# EAGLE design stm32h405-braids (EAGLE 7.2.0)
Braids for Olimex STM32H103 or H405 with some tweaks

## Sheet 1 of 2
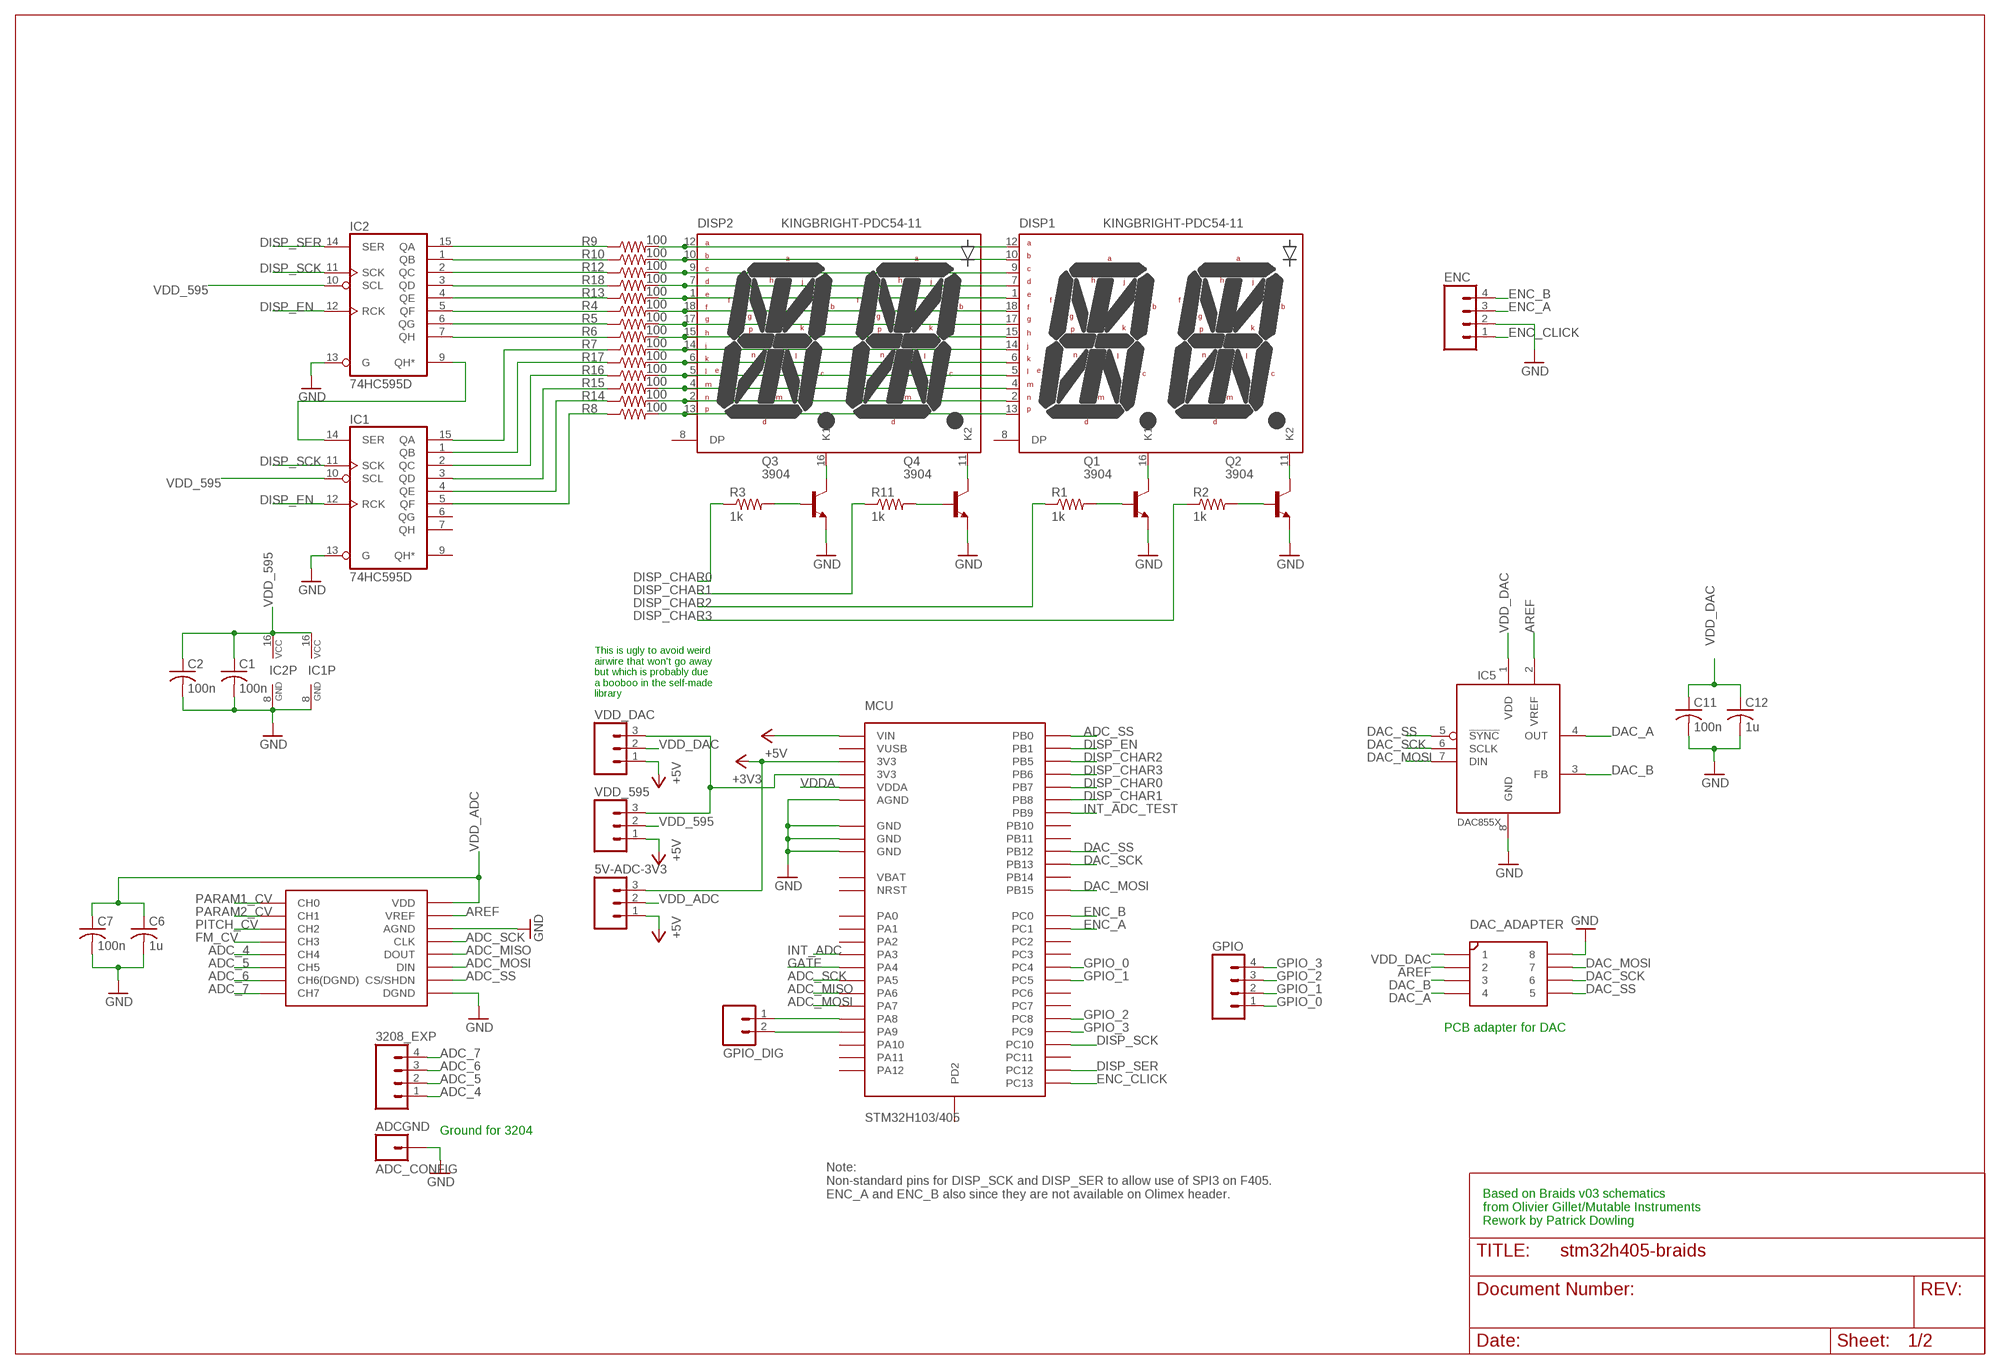
[diagram p0: schematic, sheet 1]

### Parts
5V-ADC-3V3  M031X03_NO_SILK  [1X03_NO_SILK]
3208_EXP  M041X04_NO_SILK  [1X04_NO_SILK]
ADCGND  ADC_CONFIG  M01NOSILK-KIT  [1X01NS-KIT]
C1  100n  C-USC0805  [C0805]
C2  100n  C-USC0805  [C0805]
C6  1u  C-USC0805  [C0805]
C7  100n  C-USC0805  [C0805]
C11  100n  C-USC0805  [C0805]
C12  1u  C-USC0805  [C0805]
DAC_ADAPTER  DILSOP  [DILSOP]
DISP1  KINGBRIGHT-PDC54-11  [PDC54]
DISP2  KINGBRIGHT-PDC54-11  [PDC54]
ENC  M04PTH  [1X04]
GPIO  M04NO_SILK_ALL_ROUND  [1X04_NO_SILK_ALL_ROUND]
GPIO_DIG  M02PTH  [1X02]
IC1  74HC595D  [SO16]
IC2  74HC595D  [SO16]
IC4  MCP3204/3208  MCP320X  [DIL16]
IC5  DAC855X  [MSOP-8]
MCU  STM32H103/405  STM32H103  [STM32H103]
Q1  3904  MMBT3904LT1-NPN-SOT23-BEC  [SOT23-BEC]
Q2  3904  MMBT3904LT1-NPN-SOT23-BEC  [SOT23-BEC]
Q3  3904  MMBT3904LT1-NPN-SOT23-BEC  [SOT23-BEC]
Q4  3904  MMBT3904LT1-NPN-SOT23-BEC  [SOT23-BEC]
R1  1k  R-US_R0805  [R0805]
R2  1k  R-US_R0805  [R0805]
R3  1k  R-US_R0805  [R0805]
R4  100  R-US_R0603  [R0603]
R5  100  R-US_R0603  [R0603]
R6  100  R-US_R0603  [R0603]
R7  100  R-US_R0603  [R0603]
R8  100  R-US_R0603  [R0603]
R9  100  R-US_R0603  [R0603]
R10  100  R-US_R0603  [R0603]
R11  1k  R-US_R0805  [R0805]
R12  100  R-US_R0603  [R0603]
R13  100  R-US_R0603  [R0603]
R14  100  R-US_R0603  [R0603]
R15  100  R-US_R0603  [R0603]
R16  100  R-US_R0603  [R0603]
R17  100  R-US_R0603  [R0603]
R18  100  R-US_R0603  [R0603]
VDD_595  M031X03_NO_SILK  [1X03_NO_SILK]
VDD_DAC  M031X03_NO_SILK  [1X03_NO_SILK]

### Nets
+3V3: 5V-ADC-3V3.3 MCU.EXT1-5(3V3) ; also sheet 2
+5V: 5V-ADC-3V3.1 MCU.EXT2-26(VIN) VDD_595.1 VDD_DAC.1 ; also sheet 2
ADC_4: 3208_EXP.1 IC4.5(CH4)
ADC_5: 3208_EXP.2 IC4.6(CH5)
ADC_6: 3208_EXP.3 IC4.7(CH6(DGND))
ADC_7: 3208_EXP.4 IC4.8(CH7)
ADC_MISO: IC4.12(DOUT) MCU.EXT1-14(PA6)
ADC_MOSI: IC4.11(DIN) MCU.EXT1-22(PA7)
ADC_SCK: IC4.13(CLK) MCU.EXT1-18(PA5)
ADC_SS: IC4.10(CS/SHDN) MCU.EXT1-21(PB0)
AREF [AREF]: DAC_ADAPTER.P$2 IC4.15(VREF) IC5.2(VREF) ; also sheet 2
DAC_A: DAC_ADAPTER.P$4 IC5.4(OUT) ; also sheet 2
DAC_B: DAC_ADAPTER.P$3 IC5.3(FB) ; also sheet 2
DAC_MOSI: DAC_ADAPTER.P$7 IC5.7(DIN) MCU.EXT2-19(PB15)
DAC_SCK: DAC_ADAPTER.P$6 IC5.6(SCLK) MCU.EXT2-16(PB13)
DAC_SS: DAC_ADAPTER.P$5 IC5.5(!SYNC) MCU.EXT2-17(PB12)
DISP_CHAR0: MCU.EXT1-15(PB7) R3.1
DISP_CHAR1: MCU.EXT1-16(PB8) R11.1
DISP_CHAR2: MCU.EXT1-12(PB5) R1.1
DISP_CHAR3: MCU.EXT1-13(PB6) R2.1
DISP_EN: IC1.12(RCK) IC2.12(RCK) MCU.EXT1-26(PB1)
DISP_SCK: IC1.11(SCK) IC2.11(SCK) MCU.EXT1-8(PC10)
DISP_SER: IC2.14(SER) MCU.EXT1-10(PC12)
ENC_A: ENC.3 MCU.EXT1-20(PC1)
ENC_B: ENC.4 MCU.EXT1-19(PC0)
ENC_CLICK: ENC.1 MCU.EXT1-24(PC13)
FM_CV: IC4.4(CH3) ; also sheet 2
GATE: MCU.EXT2-11(PA4) ; also sheet 2
GND: ADCGND.1 C1.2 C2.2 C6.2 C7.2 C11.2 C12.2 DAC_ADAPTER.P$8 ENC.2 IC1.8(GND) IC1.13(G) IC2.8(GND) IC2.13(G) IC4.9(DGND) IC4.14(AGND) IC5.8(GND) MCU.EXT1-6(GND) MCU.EXT2-3(AGND) MCU.EXT2-6(GND) MCU.EXT2-25(GND) Q1.E Q2.E Q3.E Q4.E ; also sheet 2
GPIO_0: GPIO.1 MCU.EXT2-12(PC4)
GPIO_1: GPIO.2 MCU.EXT2-13(PC5)
GPIO_2: GPIO.3 MCU.EXT2-22(PC8)
GPIO_3: GPIO.4 MCU.EXT2-24(PC9)
INT_ADC: MCU.EXT2-10(PA3)
INT_ADC_TEST: MCU.EXT1-17(PB9)
N$1: IC1.14(SER) IC2.9(QH*)
N$2: DISP2.16(K1) Q3.C
N$3: DISP1.12(A) DISP2.12(A) R9.2
N$5: IC2.15(QA) R9.1
N$7: IC2.1(QB) R10.1
N$8: IC2.2(QC) R12.1
N$9: IC2.3(QD) R18.1
N$10: IC2.4(QE) R13.1
N$11: IC2.5(QF) R4.1
N$12: IC2.6(QG) R5.1
N$13: IC2.7(QH) R6.1
N$14: IC1.15(QA) R7.1
N$15: IC1.1(QB) R17.1
N$16: IC1.2(QC) R16.1
N$17: IC1.3(QD) R15.1
N$18: IC1.4(QE) R14.1
N$19: IC1.5(QF) R8.1
N$20: DISP1.10(B) DISP2.10(B) R10.2
N$21: DISP1.9(C) DISP2.9(C) R12.2
N$22: DISP1.7(D) DISP2.7(D) R18.2
N$23: DISP1.5(L) DISP2.5(L) R16.2
N$24: DISP1.1(E) DISP2.1(E) R13.2
N$25: DISP1.18(F) DISP2.18(F) R4.2
N$26: DISP1.17(G) DISP2.17(G) R5.2
N$27: DISP1.15(H) DISP2.15(H) R6.2
N$28: DISP1.14(J) DISP2.14(J) R7.2
N$29: DISP1.6(K) DISP2.6(K) R17.2
N$30: DISP1.4(M) DISP2.4(M) R15.2
N$31: DISP1.2(N) DISP2.2(N) R14.2
N$32: DISP1.13(P) DISP2.13(P) R8.2
N$33: Q3.B R3.2
N$34: Q4.B R11.2
N$35: DISP2.11(K2) Q4.C
N$36: DISP1.16(K1) Q1.C
N$37: Q1.B R1.2
N$38: Q2.B R2.2
N$39: DISP1.11(K2) Q2.C
N$63: MCU.EXT2-5(3V3) VDD_595.3 VDD_DAC.3
N$64: GPIO_DIG.1 MCU.EXT1-2(PA8)
N$65: GPIO_DIG.2 MCU.EXT1-4(PA9)
PARAM1_CV: IC4.1(CH0) ; also sheet 2
PARAM2_CV: IC4.2(CH1) ; also sheet 2
PITCH_CV: IC4.3(CH2) ; also sheet 2
VDD_595: C1.1 C2.1 IC1.10(SCL) IC1.16(VCC) IC2.10(SCL) IC2.16(VCC) VDD_595.2
VDD_ADC: 5V-ADC-3V3.2 C6.1 C7.1 IC4.16(VDD)
VDD_DAC [VDD]: C11.1 C12.1 DAC_ADAPTER.P$1 IC5.1(VDD) VDD_DAC.2
VDDA [VDDA]: MCU.EXT2-1(VDDA) ; also sheet 2
Unconnected: DISP1.8(DP) DISP2.8(DP) IC1.6(QG) IC1.7(QH) IC1.9(QH*) MCU.EXT1-1(PA11) MCU.EXT1-3(PA12) MCU.EXT1-7(PA10) MCU.EXT1-9(PC11) MCU.EXT1-11(PD2) MCU.EXT1-23(VBAT) MCU.EXT1-25(NRST) MCU.EXT2-2(PC2) MCU.EXT2-4(PA0) MCU.EXT2-7(PA2) MCU.EXT2-8(PA1) MCU.EXT2-9(PC3) MCU.EXT2-14(PB10) MCU.EXT2-15(PB11) MCU.EXT2-18(PB14) MCU.EXT2-20(PC6) MCU.EXT2-21(PC7) MCU.EXT2-23(VUSB)

### Notes on the sheet
- This is ugly to avoid weird
  airwire that won't go away
  but which is probably due
  a booboo in the self-made
  library
- PCB adapter for DAC
- Ground for 3204
- Note:
  Non-standard pins for DISP_SCK and DISP_SER to allow use of SPI3 on F405.
  ENC_A and ENC_B also since they are not available on Olimex header.
- Based on Braids v03 schematics
  from Olivier Gillet/Mutable Instruments
  Rework by Patrick Dowling

## Sheet 2 of 2
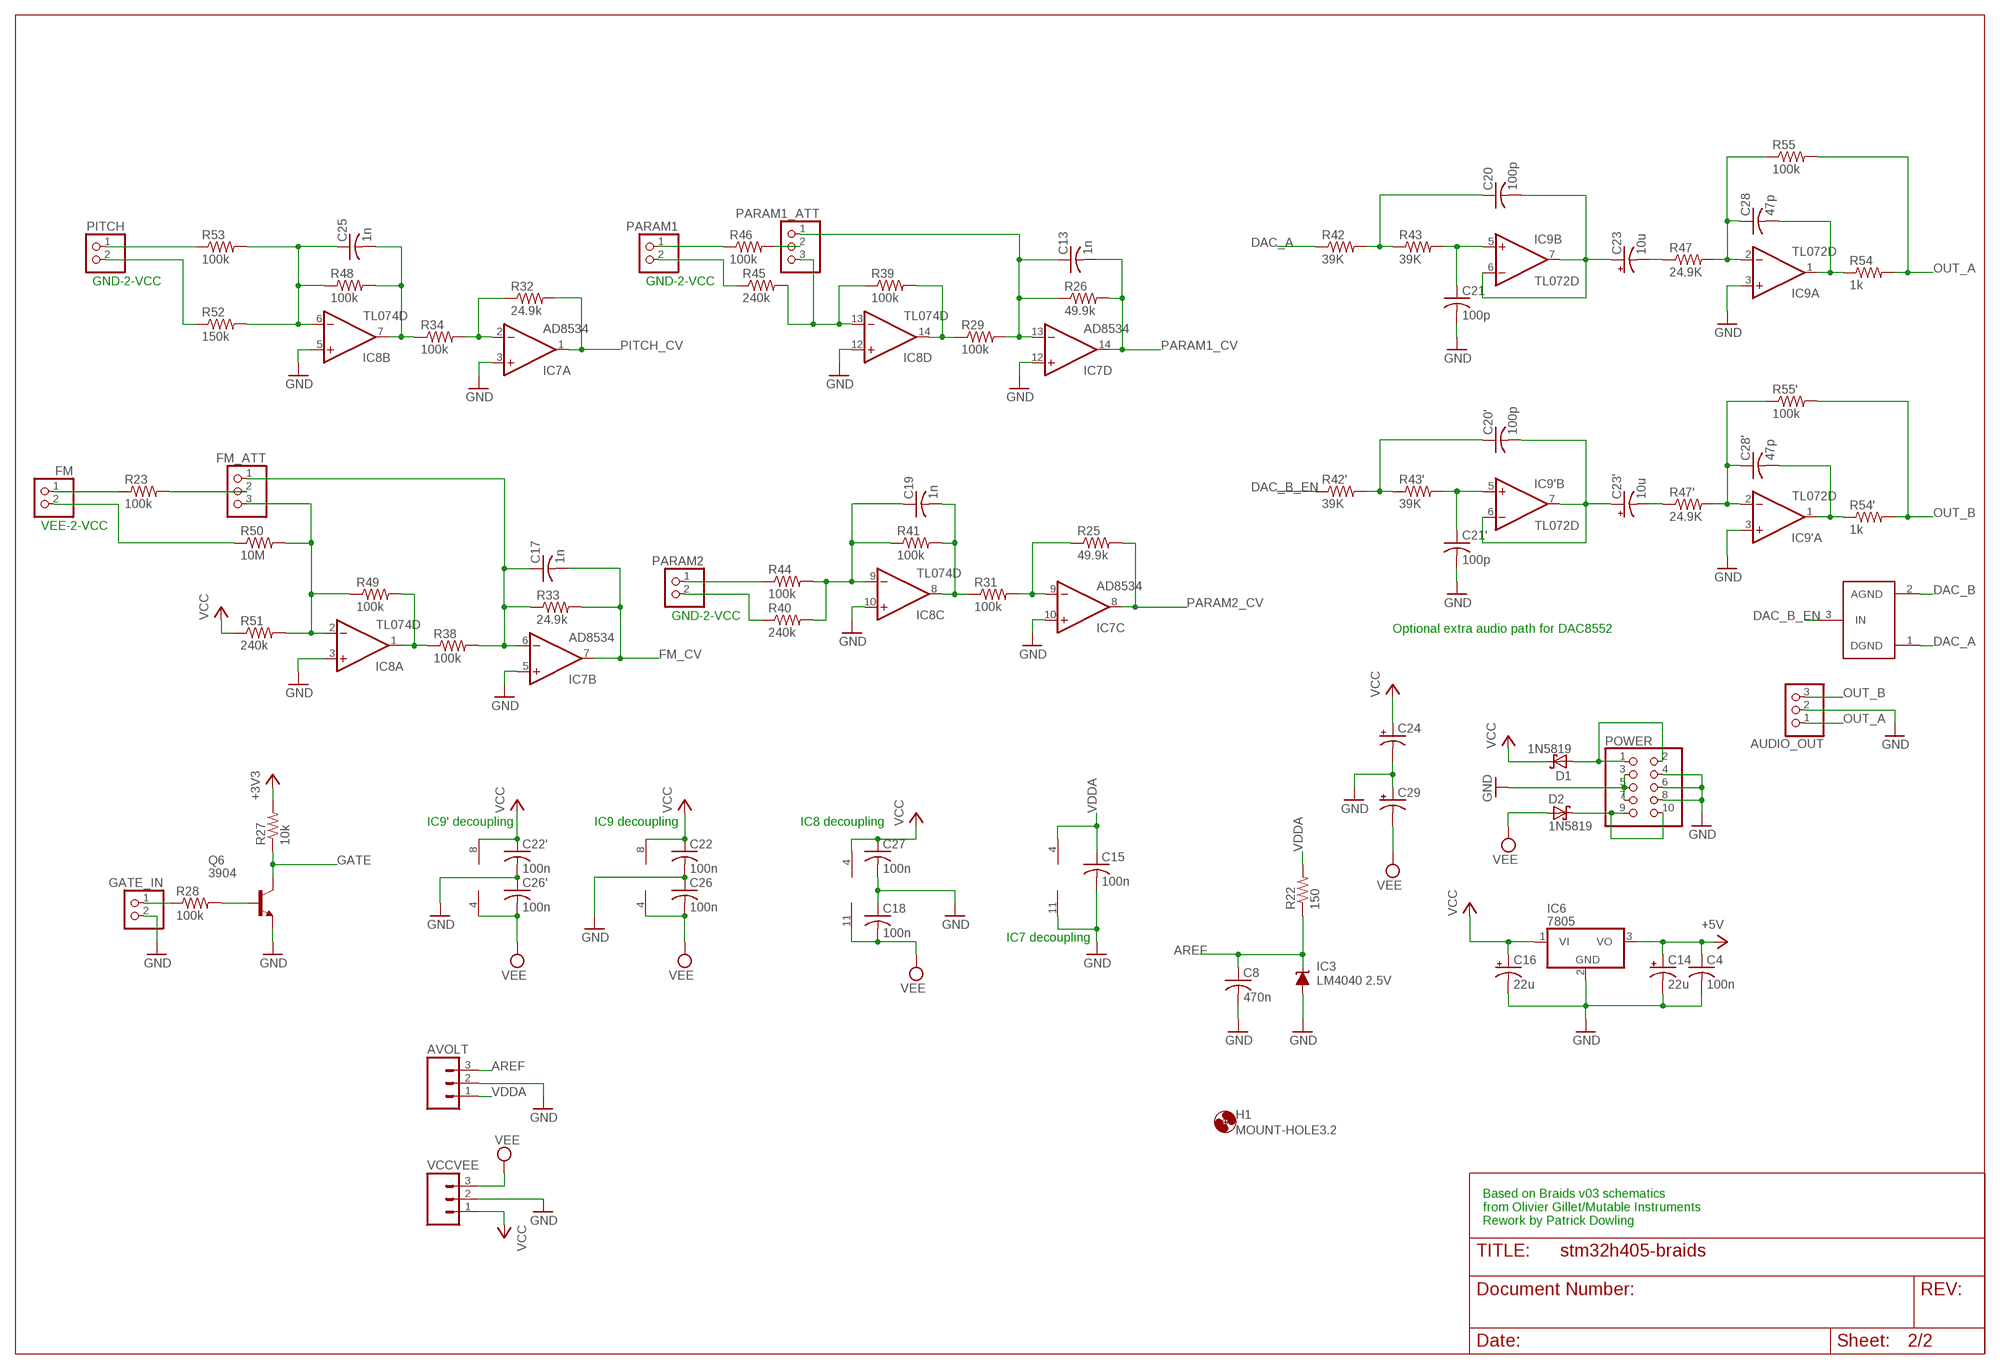
[diagram p1: schematic, sheet 2]

### Parts
AUDIO_OUT  PINHD-1X3  [1X03]
AVOLT  M031X03_NO_SILK  [1X03_NO_SILK]
C4  100n  C-US025-024X044  [C025-024X044]
C8  470n  C-USC0805  [C0805]
C13  1n  C-USC0805  [C0805]
C14  22u  CPOL-USE2.5-6  [E2,5-6]
C15  100n  C-USC0805  [C0805]
C16  22u  CPOL-USE2.5-6  [E2,5-6]
C17  1n  C-USC0805  [C0805]
C18  100n  C-USC0805  [C0805]
C19  1n  C-USC0805  [C0805]
C20  100p  C-USC0805  [C0805]
C20'  100p  C-USC0805  [C0805]
C21  100p  C-USC0805  [C0805]
C21'  100p  C-USC0805  [C0805]
C22  100n  C-USC0805  [C0805]
C22'  100n  C-USC0805  [C0805]
C23  10u  CPOL-USE2-5  [E2-5]
C23'  10u  CPOL-USE2-5  [E2-5]
C24  CPOL-USE2.5-6  [E2,5-6]
C25  1n  C-USC0805  [C0805]
C26  100n  C-USC0805  [C0805]
C26'  100n  C-USC0805  [C0805]
C27  100n  C-USC0805  [C0805]
C28  47p  C-USC0805  [C0805]
C28'  47p  C-USC0805  [C0805]
C29  CPOL-USE2.5-6  [E2,5-6]
D1  1N5819  1N5819-B  [DO41-7.6]
D2  1N5819  1N5819-B  [DO41-7.6]
DAC_CONF  GND_CONNECT  [GND_CONNECT]
FM  PINHD-1X2  [1X02]
FM_ATT  PINHD-1X3  [1X03]
GATE_IN  PINHD-1X2  [1X02]
H1  MOUNT-HOLE3.2  [3,2]
IC3  LM4040 2.5V  LM4041B12DBZ  [DBZ_R-PDSO-G3]
IC6  7805  7805TV  [TO220V]
IC7  AD8534  TL074D  [SO14]
IC8  TL074D  [SO14]
IC9  TL072D  [SO08]
IC9'  TL072D  [SO08]
PARAM1  PINHD-1X2  [1X02]
PARAM1_ATT  PINHD-1X3  [1X03]
PARAM2  PINHD-1X2  [1X02]
PITCH  PINHD-1X2  [1X02]
POWER  PINHD-2X5  [2X05]
Q6  3904  MMBT3904LT1-NPN-SOT23-BEC  [SOT23-BEC]
R22  150  R-US_R0805  [R0805]
R23  100k  R-US_R0805  [R0805]
R25  49.9k  R-US_R0805  [R0805]
R26  49.9k  R-US_R0805  [R0805]
R27  10k  R-US_R0805  [R0805]
R28  100k  R-US_R0805  [R0805]
R29  100k  R-US_R0805  [R0805]
R31  100k  R-US_R0805  [R0805]
R32  24.9k  R-US_R0805  [R0805]
R33  24.9k  R-US_R0805  [R0805]
R34  100k  R-US_R0805  [R0805]
R38  100k  R-US_R0805  [R0805]
R39  100k  R-US_R0805  [R0805]
R40  240k  R-US_R0805  [R0805]
R41  100k  R-US_R0805  [R0805]
R42  39K  R-US_R0805  [R0805]
R42'  39K  R-US_R0805  [R0805]
R43  39K  R-US_R0805  [R0805]
R43'  39K  R-US_R0805  [R0805]
R44  100k  R-US_R0805  [R0805]
R45  240k  R-US_R0805  [R0805]
R46  100k  R-US_R0805  [R0805]
R47  24.9K  R-US_R0805  [R0805]
R47'  24.9K  R-US_R0805  [R0805]
R48  100k  R-US_R0805  [R0805]
R49  100k  R-US_R0805  [R0805]
R50  10M  R-US_R0805  [R0805]
R51  240k  R-US_R0805  [R0805]
R52  150k  R-US_R0805  [R0805]
R53  100k  R-US_R0805  [R0805]
R54  1k  R-US_R0805  [R0805]
R54'  1k  R-US_R0805  [R0805]
R55  100k  R-US_R0805  [R0805]
R55'  100k  R-US_R0805  [R0805]
VCCVEE  M031X03_NO_SILK  [1X03_NO_SILK]

### Nets
+3V3: R27.2 ; also sheet 1
+5V: C4.1 C14.+ IC6.3(VO) ; also sheet 1
AREF [AREF]: AVOLT.3 C8.1 IC3.1(C) R22.1 ; also sheet 1
C28': C28'.2 IC9'.1(A:OUT) R54'.1
DAC_A: DAC_CONF.1(DGND) R42.1 ; also sheet 1
DAC_B: DAC_CONF.2(AGND) ; also sheet 1
DAC_B_EN: DAC_CONF.3(IN) R42'.1
FM_CV: C17.2 IC7.7(B:OUT) R33.2 ; also sheet 1
GATE: Q6.C R27.1 ; also sheet 1
GND: AUDIO_OUT.2 AVOLT.2 C4.2 C8.2 C14.- C15.2 C16.- C18.1 C21'.2 C21.2 C22'.2 C22.2 C24.- C26'.1 C26.1 C27.2 C29.+ GATE_IN.2 IC3.2(A) IC6.2(GND) IC7.3(A:+IN) IC7.5(B:+IN) IC7.10(C:+IN) IC7.11(P:V-) IC7.12(D:+IN) IC8.3(A:+IN) IC8.5(B:+IN) IC8.10(C:+IN) IC8.12(D:+IN) IC9'.3(A:+IN) IC9.3(A:+IN) POWER.3 POWER.4 POWER.5 POWER.6 POWER.7 POWER.8 Q6.E VCCVEE.2 ; also sheet 1
N$4: D2.C POWER.9 POWER.10
N$6: D1.A POWER.1 POWER.2
N$41: C20.1 R42.2 R43.1
N$42: C21.1 IC9.5(B:+IN) R43.2
N$43: C20.2 C23.+ IC9.6(B:-IN) IC9.7(B:OUT)
N$44: C28.1 IC9.2(A:-IN) R47.2 R55.1
N$45: C23.- R47.1
N$46: C28.2 IC9.1(A:OUT) R54.1
N$47: FM_ATT.3 IC8.2(A:-IN) R49.1 R50.2 R51.2
N$48: IC8.1(A:OUT) R38.1 R49.2
N$49: FM.2 R50.1
N$50: C25.2 IC8.7(B:OUT) R34.1 R48.2
N$51: C25.1 IC8.6(B:-IN) R48.1 R52.2 R53.2
N$52: IC8.14(D:OUT) R29.1 R39.2
N$53: IC8.13(D:-IN) PARAM1_ATT.3 R39.1 R45.2
N$54: C19.2 IC8.8(C:OUT) R31.1 R41.2
N$55: C19.1 IC8.9(C:-IN) R40.2 R41.1 R44.2
N$56: IC7.9(C:-IN) R25.1 R31.2
N$57: C17.1 FM_ATT.1 IC7.6(B:-IN) R33.1 R38.2
N$58: IC7.2(A:-IN) R32.1 R34.2
N$59: C13.1 IC7.13(D:-IN) PARAM1_ATT.1 R26.1 R29.2
N$60: Q6.B R28.2
N$61: FM_ATT.2 R23.2
N$66: GATE_IN.1 R28.1
N$67: FM.1 R23.1
N$69: PITCH.1 R53.1
N$70: PITCH.2 R52.1
N$71: PARAM2.1 R44.1
N$72: PARAM2.2 R40.1
N$73: PARAM1.2 R45.1
N$74: PARAM1.1 R46.1
N$75: PARAM1_ATT.2 R46.2
N$76: C20'.1 R42'.2 R43'.1
N$77: C21'.1 IC9'.5(B:+IN) R43'.2
N$78: C20'.2 C23'.+ IC9'.6(B:-IN) IC9'.7(B:OUT)
N$79: C28'.1 IC9'.2(A:-IN) R47'.2 R55'.1
N$80: C23'.- R47'.1
OUT_A: AUDIO_OUT.1 R54.2 R55.2
OUT_B: AUDIO_OUT.3 R54'.2 R55'.2
PARAM1_CV: C13.2 IC7.14(D:OUT) R26.2 ; also sheet 1
PARAM2_CV: IC7.8(C:OUT) R25.2 ; also sheet 1
PITCH_CV: IC7.1(A:OUT) R32.2 ; also sheet 1
VCC [VCC]: C16.+ C22'.1 C22.1 C24.+ C27.1 D1.C IC6.1(VI) IC8.4(P:V+) IC9'.8(P:V+) IC9.8(P:V+) R51.1 VCCVEE.1
VDDA [VDDA]: AVOLT.1 C15.1 IC7.4(P:V+) R22.2 ; also sheet 1
VEE [VEE]: C18.2 C26'.2 C26.2 C29.- D2.A IC8.11(P:V-) IC9'.4(P:V-) IC9.4(P:V-) VCCVEE.3

### Notes on the sheet
- GND-2-VCC | GND-2-VCC
- VEE-2-VCC
- GND-2-VCC
- Optional extra audio path for DAC8552
- IC9' decoupling | IC9 decoupling | IC8 decoupling
- IC7 decoupling
- Based on Braids v03 schematics
  from Olivier Gillet/Mutable Instruments
  Rework by Patrick Dowling

## Library data of the parts
5V-ADC-3V3 AVOLT VCCVEE VDD_595 VDD_DAC = SparkFun-Connectors:M03: Header 3 Standard 3-pin 0.1" header. Use with straight break away headers (SKU : PRT-00116), right angle break away headers (PRT-00553), swiss pins (PRT-00743), machine pins (PRT-00117), and female headers (PRT-00115). Molex polarized connector foot print use with SKU : PRT-08232 with associated crimp pins and housings.
3208_EXP ENC GPIO = SparkFun-Connectors:M04: Header 4 Standard 4-pin 0.1" header. Use with straight break away headers (SKU : PRT-00116), right angle break away headers (PRT-00553), swiss pins (PRT-00743), machine pins (PRT-00117), and female headers (PRT-00115). Molex polarized connector foot print use with SKU : PRT-08231 with associated crimp pins and housings. 1MM SMD Version SKU: PRT-10208
ADCGND = SparkFun-Connectors:M01: Header 1 Standard 1-pin 0.1" header. Use with straight break away headers (SKU : PRT-00116), right angle break away headers (PRT-00553), swiss pins (PRT-00743), machine pins (PRT-00117), and female headers (PRT-00115).
AUDIO_OUT FM_ATT PARAM1_ATT = pinhead:PINHD-1X3: PIN HEADER
C1 C2 C4 C6-C8 C11-C13 C15 C17-C20 C20' C21 C21' C22 C22' C25 C26 C26' C27 C28 C28' = rcl:C-US: CAPACITOR, American symbol
C14 C16 C23 C23' C24 C29 = rcl:CPOL-US: POLARIZED CAPACITOR, American symbol
D1 D2 = diode:1N581*: 1.0A SCHOTTKY BARRIER RECTIFIER Source: http://www.diodes.com/datasheets/ds23001.pdf
DAC_ADAPTER = dilsop:DILSOP
DAC_CONF = SparkFun-Passives:GND_CONNECT: Use to make a connection of multiple grounds in only one place.
DISP1 DISP2 = og-display:KINGBRIGHT-PDC54-11: Kingbright PDC54-11GWA ; also compatible with LITE-On LTP-3784G or Avago HDSP-A27C
FM GATE_IN PARAM1 PARAM2 PITCH = pinhead:PINHD-1X2: PIN HEADER
GPIO_DIG = SparkFun-Connectors:M02: Standard 2-pin 0.1" header. Use with - straight break away headers ( PRT-00116) - right angle break away headers (PRT-00553) - swiss pins (PRT-00743) - machine pins (PRT-00117) - female headers (PRT-00115) Molex polarized connector foot print use with: PRT-08233 with associated crimp pins and housings. 2.54_SCREWTERM for use with PRT-10571. 3.5mm Screw Terminal footprints for PRT-08084 5mm Screw Terminal footprints for use with PRT-08432
H1 = holes:MOUNT-HOLE: MOUNTING HOLE with drill center marker
IC1 IC2 = 74xx-eu:74*595: 8-bit SHIFT REGISTER, output latch
IC3 = texas:LM4041: PRECISION MICROPOWER SHUNT VOLTAGE REFERENCE Source: http://focus.ti.com/lit/ds/slcs146e/slcs146e.pdf; MPN: LM4041B12IDBZR; OC_FARNELL: 1575212; OC_NEWARK: 58K5882
IC4 = mcp320x:MCP320X: MCP3204/3208
IC5 = og-dac:DAC855X: 16-bit low-glitch DAC with 2's complement (8550) or unsigned code (8551)
IC6 = linear:78*: Positive VOLTAGE REGULATOR Source: http://cache.national.com/ds/LM/LM78L05.pdf http://www.fairchildsemi.com/ds/LM/LM7805.pdf
IC7 IC8 = gm-ics:TL074: OP AMP
IC9 IC9' = linear:TL072: OP AMP
MCU = olimex-stm32h:STM32H103: Olimex STM32H103 and H405
POWER = pinhead:PINHD-2X5: PIN HEADER
Q1-Q4 Q6 = transistor:*-NPN-: NPN Transistror BF959 corrected 2008.03.06
R1-R18 R22 R23 R25-R29 R31-R34 R38-R42 R42' R43 R43' R44-R47 R47' R48-R54 R54' R55 R55' = rcl:R-US_: RESISTOR, American symbol

## Net classes
1 VDDA: width 0.305 mm
2 VDD: width 0.305 mm
3 VEE: width 0.305 mm
4 VCC: width 0.305 mm
5 AREF: width 0.305 mm

## Board
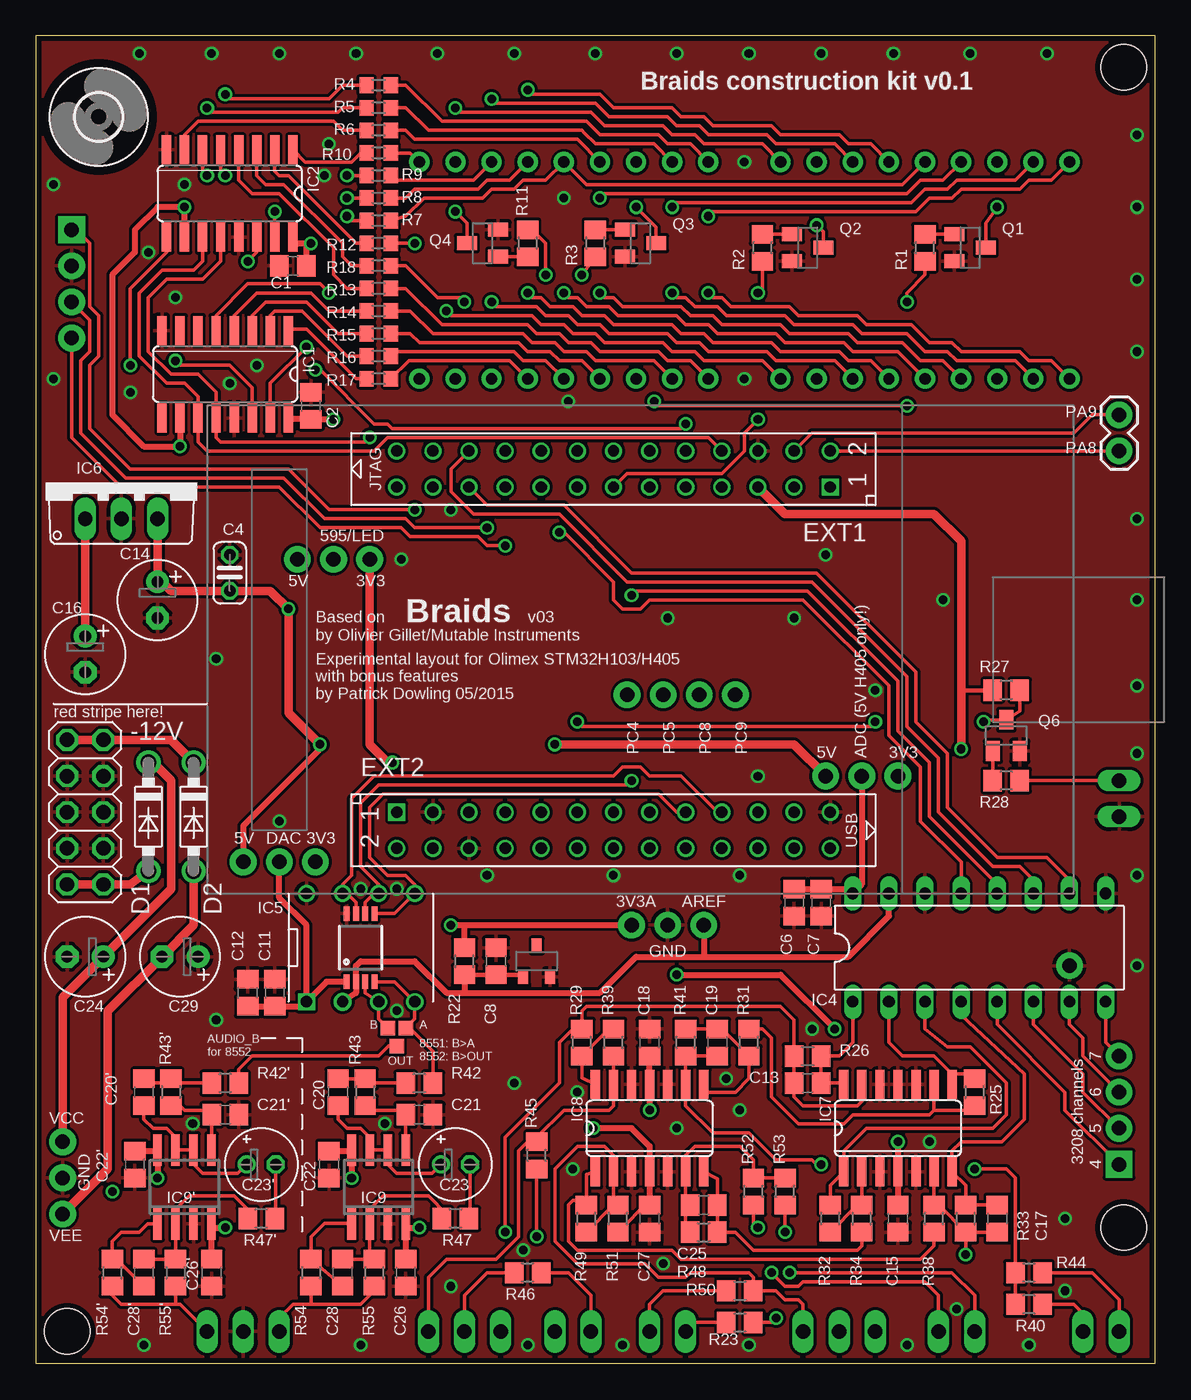
[diagram p2: board, top side]
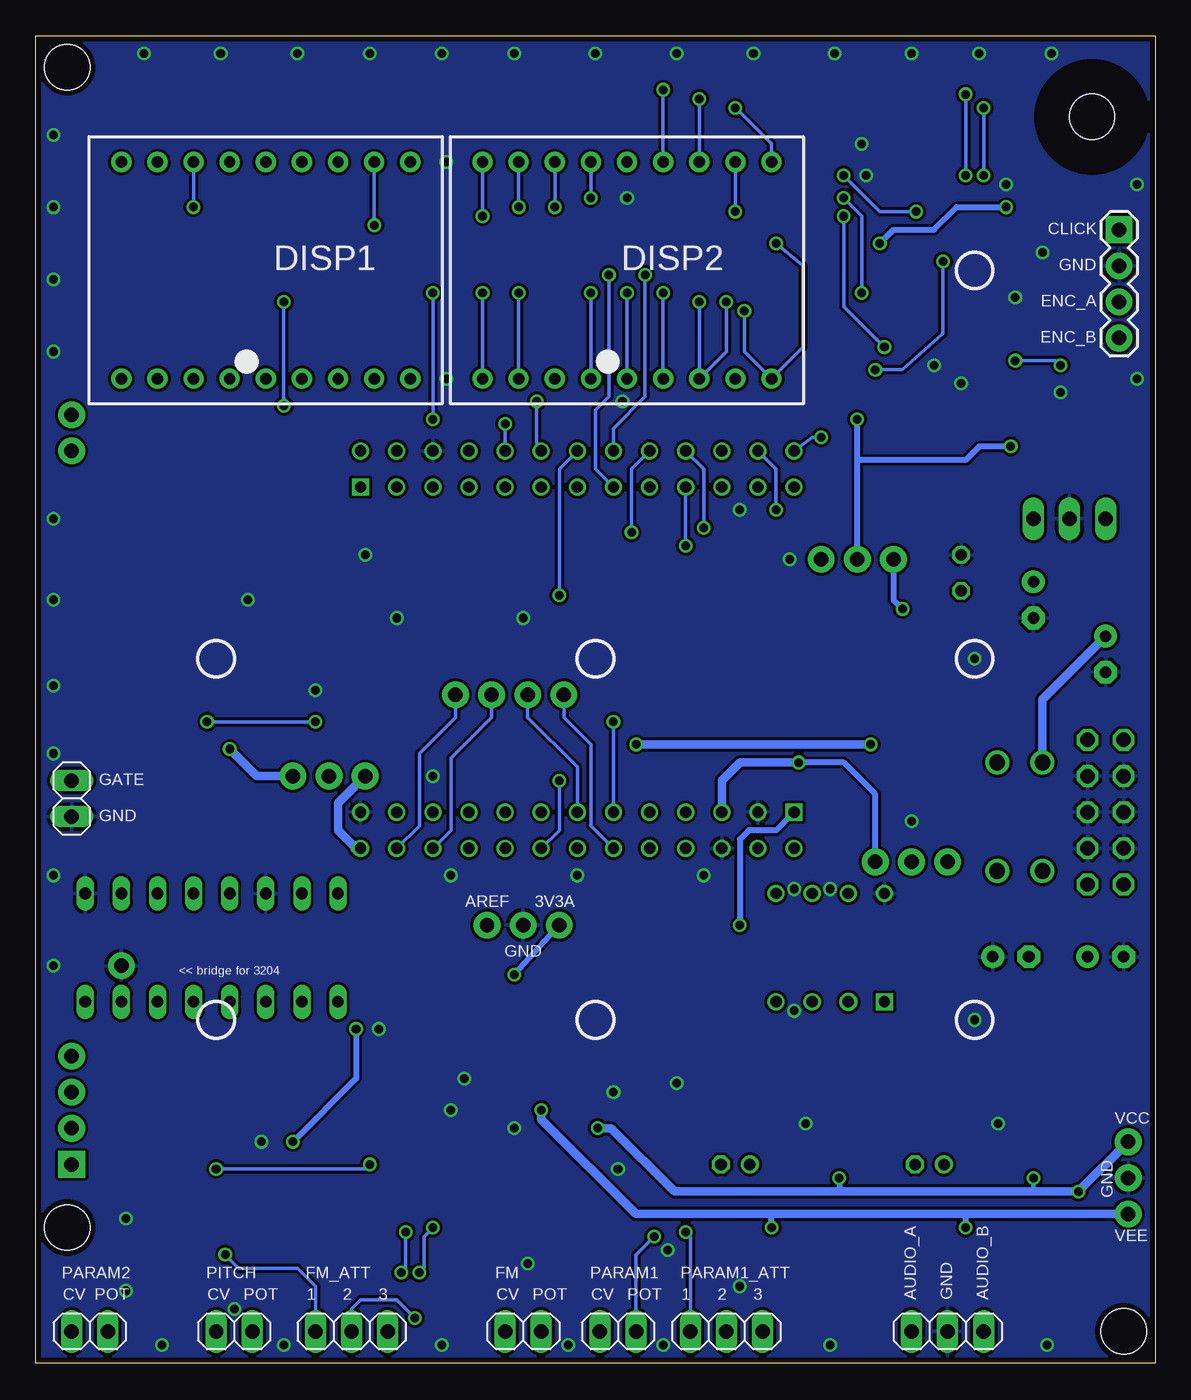
[diagram p3: board, bottom side, seen from below]

Size 78.74 x 93.34 mm. Coordinates in mm from the lower left corner, seen from the top.
Outline: 0,0 78.74,0 78.74,93.34 0,93.34 0,0
Copper layers (1*16): Top 0.0356mm / dielectric 1.5011mm / Bottom 0.0356mm
Design rules "LaenPCBOrder *": minimum track width 6mil, minimum drill 13mil, track to track 8mil, track to pad 8mil, pad to pad 8mil, via to via 8mil, smd to smd 6mil, copper to edge 15mil, drill to drill 6mil, minimum pad ring 7mil, minimum via ring 7mil, stop-mask expansion 3mil, vias tented up to drill 25mil, thermal gap 10mil
Holes 3.2 mm at 76.52,9.53 76.52,91.12 2.22,2.22

### Footprints (pad centres in the part's own frame; a part is rotated, then mirrored left to right if it is on the bottom)
1X03_NO_SILK = drill 1.016 pad 1.88: 1 0,0; 2 2.54,0; 3 5.08,0
1X04_NO_SILK = drill 1.016 pad 1.88 square: 1 0,0 | drill 1.016 pad 1.88: 2 2.54,0; 3 5.08,0; 4 7.62,0
1X01NS-KIT = drill 1.016 pad 1.88: 1 0,0
1X03 = drill 1.016 long: 1 -2.54,0; 2 0,0; 3 2.54,0
C0805 = smd 1.3 x 1.5: 1 -0.95,0; 2 0.95,0
C025-024X044 = drill 0.813 octagon: 1 -1.27,0; 2 1.27,0
E2,5-6 = drill 0.813 pad 1.6: + -1.27,0 | drill 0.813 pad 1.6 octagon: - 1.27,0
E2-5 = drill 0.813 pad 1.27: + -1.016,0 | drill 0.813 pad 1.27 octagon: - 1.016,0
DO41-7.6 = drill 1.1 pad 1.7: A 3.81,0; C -3.81,0
DILSOP = drill 0.8 square: P$1 -3.81,-3.81 | drill 0.8 pad 1.27: P$2 -1.27,-3.81 | drill 0.8: P$3 1.27,-3.81; P$4 3.81,-3.81; P$5 3.81,3.81; P$6 1.27,3.81; P$7 -1.27,3.81; P$8 -3.81,3.81
GND_CONNECT = smd 1.016 x 1.016: 1 -1.016,0; 2 -1.016,-1.27; 3 0.254,-0.635
PDC54 = drill 0.8 pad 1.422: 1 -10.16,-7.62; 2 -7.62,-7.62; 3 -5.08,-7.62; 4 -2.54,-7.62; 5 0,-7.62; 6 2.54,-7.62; 7 5.08,-7.62; 8 7.62,-7.62; 9 10.16,-7.62; 10 10.16,7.62; 11 7.62,7.62; 12 5.08,7.62; 13 2.54,7.62; 14 0,7.62; 15 -2.54,7.62; 16 -5.08,7.62; 17 -7.62,7.62; 18 -10.16,7.62
1X04 = drill 1.016 pad 1.88 square: 1 0,0 | drill 1.016 pad 1.88: 2 2.54,0; 3 5.08,0; 4 7.62,0
1X02 = drill 1.016 long: 1 -1.27,0; 2 1.27,0
1X04_NO_SILK_ALL_ROUND = drill 1.016 pad 1.88: 1 0,0; 2 2.54,0; 3 5.08,0; 4 7.62,0
1X02' = drill 1.016 pad 1.88: 1 0,0; 2 2.54,0
3,2 = hole 3.2: 0,0
SO16 = smd 0.66 x 2.032: 1 -4.445,-3.073; 2 -3.175,-3.073; 3 -1.905,-3.073; 4 -0.635,-3.073; 5 0.635,-3.073; 6 1.905,-3.073; 7 3.175,-3.073; 8 4.445,-3.073; 9 4.445,3.073; 10 3.175,3.073; 11 1.905,3.073; 12 0.635,3.073; 13 -0.635,3.073; 14 -1.905,3.073; 15 -3.175,3.073; 16 -4.445,3.073
DBZ_R-PDSO-G3 = smd 0.7 x 1: 1 -0.95,-1.1; 2 0.95,-1.1; 3 0,1.1
DIL16 = drill 0.813 long: 1 -8.89,-3.81; 2 -6.35,-3.81; 3 -3.81,-3.81; 4 -1.27,-3.81; 5 1.27,-3.81; 6 3.81,-3.81; 7 6.35,-3.81; 8 8.89,-3.81; 9 8.89,3.81; 10 6.35,3.81; 11 3.81,3.81; 12 1.27,3.81; 13 -1.27,3.81; 14 -3.81,3.81; 15 -6.35,3.81; 16 -8.89,3.81
MSOP-8 = smd 0.41 x 1.02: 1 -0.975,-2.4; 2 -0.325,-2.4; 3 0.325,-2.4; 4 0.975,-2.4; 5 0.975,2.4; 6 0.325,2.4; 7 -0.325,2.4; 8 -0.975,2.4
TO220V = drill 1.016 long: 1 -2.54,-2.54; 2 0,-2.54; 3 2.54,-2.54
SO14 = smd 0.66 x 2.032: 1 -3.81,-3.073; 2 -2.54,-3.073; 3 -1.27,-3.073; 4 0,-3.073; 5 1.27,-3.073; 6 2.54,-3.073; 7 3.81,-3.073; 8 3.81,3.073; 9 2.54,3.073; 10 1.27,3.073; 11 0,3.073; 12 -1.27,3.073; 13 -2.54,3.073; 14 -3.81,3.073
SO08 = smd 0.6 x 2.2: 1 -1.905,-2.6; 2 -0.635,-2.6; 3 0.635,-2.6; 4 1.905,-2.6; 5 1.905,2.6; 6 0.635,2.6; 7 -0.635,2.6; 8 -1.905,2.6
STM32H103 = drill 0.8 square: EXT1-1 11.43,-15.24; EXT2-1 -11.43,15.24 | drill 0.8: EXT1-2 13.97,-15.24; EXT1-3 11.43,-12.7; EXT1-4 13.97,-12.7; EXT1-5 11.43,-10.16; EXT1-6 13.97,-10.16; EXT1-7 11.43,-7.62; EXT1-8 13.97,-7.62; EXT1-9 11.43,-5.08; EXT1-10 13.97,-5.08; EXT1-11 11.43,-2.54; EXT1-12 13.97,-2.54; EXT1-13 11.43,0; EXT1-14 13.97,0; EXT1-15 11.43,2.54; EXT1-16 13.97,2.54; EXT1-17 11.43,5.08; EXT1-18 13.97,5.08; EXT1-19 11.43,7.62; EXT1-20 13.97,7.62; EXT1-21 11.43,10.16; EXT1-22 13.97,10.16; EXT1-23 11.43,12.7; EXT1-24 13.97,12.7; EXT1-25 11.43,15.24; EXT1-26 13.97,15.24; EXT2-2 -13.97,15.24; EXT2-3 -11.43,12.7; EXT2-4 -13.97,12.7; EXT2-5 -11.43,10.16; EXT2-6 -13.97,10.16; EXT2-7 -11.43,7.62; EXT2-8 -13.97,7.62; EXT2-9 -11.43,5.08; EXT2-10 -13.97,5.08; EXT2-11 -11.43,2.54; EXT2-12 -13.97,2.54; EXT2-13 -11.43,0; EXT2-14 -13.97,0; EXT2-15 -11.43,-2.54; EXT2-16 -13.97,-2.54; EXT2-17 -11.43,-5.08; EXT2-18 -13.97,-5.08; EXT2-19 -11.43,-7.62; EXT2-20 -13.97,-7.62; EXT2-21 -11.43,-10.16; EXT2-22 -13.97,-10.16; EXT2-23 -11.43,-12.7; EXT2-24 -13.97,-12.7; EXT2-25 -11.43,-15.24; EXT2-26 -13.97,-15.24
2X05 = drill 1.016 octagon: 1 -5.08,-1.27; 2 -5.08,1.27; 3 -2.54,-1.27; 4 -2.54,1.27; 5 0,-1.27; 6 0,1.27; 7 2.54,-1.27; 8 2.54,1.27; 9 5.08,-1.27; 10 5.08,1.27
SOT23-BEC = smd 1 x 1.4: B -0.95,-1.1; C 0,1.1; E 0.95,-1.1
R0805 = smd 1.3 x 1.5: 1 -0.95,0; 2 0.95,0
R0603 = smd 1 x 1.1: 1 -0.85,0; 2 0.85,0

### Placement (x,y rotation side)
5V-ADC-3V3  55.56,41.27 0 top
3208_EXP  76.2,13.97 90 top
ADCGND  72.71,27.94 0 top
AUDIO_OUT  14.61,2.22 0 bottom
AVOLT  41.91,30.8 0 top
C1  18.1,77.15 180 top
C2  19.37,67.31 90 top
C4  13.65,55.56 90 top
C6  53.34,32.38 270 top
C7  55.24,32.38 270 top
C8  32.38,28.26 90 top
C11  16.83,26.04 90 top
C12  14.92,26.04 90 top
C13  54.29,19.68 0 top
C14  8.57,53.66 270 top
C15  60.64,10.16 270 top
C16  3.49,49.85 270 top
C17  67.63,10.16 90 top
C18  43.18,22.54 270 top
C19  47.94,22.54 90 top
C20  21.27,19.05 270 top
C20'  7.62,19.05 270 top
C21  26.99,17.46 0 top
C21'  13.34,17.46 0 top
C22  20.64,13.97 270 top
C22'  6.99,13.97 270 top
C23  29.53,13.97 0 top
C23'  15.88,13.97 0 top
C24  3.49,28.57 180 top
C25  46.99,11.11 0 top
C26  26.04,6.35 90 top
C26'  12.38,6.35 90 top
C27  43.18,10.16 270 top
C28  21.59,6.35 270 top
C28'  7.62,6.35 270 top
C29  10.16,28.57 180 top
D1  7.94,38.42 270 top
D2  11.11,38.42 270 top
DAC_ADAPTER  22.86,29.21 0 top
DAC_CONF  26.04,22.54 270 top
DISP1  62.55,76.83 0 bottom
DISP2  37.15,76.83 0 bottom
ENC  2.54,79.69 270 bottom
FM  44.45,2.22 0 bottom
FM_ATT  56.52,2.22 0 bottom
GATE_IN  76.2,39.69 270 bottom
GPIO  41.59,46.99 0 top
GPIO_DIG  [1X02']  76.2,64.14 90 top
H1  4.45,87.63 0 top
IC1  13.34,69.53 180 top
IC2  13.65,82.23 180 top
IC3  35.24,28.26 0 top
IC4  66.36,29.21 0 top
IC5  22.86,29.21 0 top
IC6  6.03,61.91 0 top
IC7  60.64,16.51 0 top
IC8  43.18,16.51 0 top
IC9  24.13,12.38 0 top
IC9'  10.48,12.38 0 top
MCU  40.64,50.16 90 top
PARAM1  37.78,2.22 0 bottom
PARAM1_ATT  30.16,2.22 0 bottom
PARAM2  74.93,2.22 0 bottom
PITCH  64.77,2.22 0 bottom
POWER  3.49,38.73 90 top
Q1  65.72,78.42 270 top
Q2  54.29,78.42 270 top
Q3  42.55,78.74 270 top
Q4  31.43,78.74 90 top
Q6  68.26,44.13 0 top
R1  62.55,78.42 90 top
R2  51.12,78.42 90 top
R3  39.37,78.74 90 top
R4  24.13,89.85 0 top
R5  24.13,88.27 0 top
R6  24.13,86.68 0 top
R7  24.13,80.33 0 top
R8  24.13,81.92 0 top
R9  24.13,83.5 0 top
R10  24.13,85.09 0 top
R11  34.61,78.74 270 top
R12  24.13,78.74 0 top
R13  24.13,75.56 0 top
R14  24.13,73.98 0 top
R15  24.13,72.39 0 top
R16  24.13,70.8 0 top
R17  24.13,69.22 0 top
R18  24.13,77.15 0 top
R22  30.16,28.26 90 top
R23  49.53,2.86 0 top
R25  66.04,19.05 90 top
R26  54.29,21.59 0 top
R27  68.26,47.31 180 top
R28  68.26,40.96 180 top
R29  38.42,22.54 90 top
R31  50.16,22.54 90 top
R32  55.88,10.16 90 top
R33  65.41,10.16 90 top
R34  58.1,10.16 90 top
R38  63.18,10.16 90 top
R39  40.64,22.54 90 top
R40  69.85,4.13 180 top
R41  45.72,22.54 90 top
R42  26.99,19.68 180 top
R42'  13.34,19.68 180 top
R43  23.18,19.05 270 top
R43'  9.53,19.05 270 top
R44  69.85,6.35 180 top
R45  35.24,14.61 90 top
R46  34.61,6.35 180 top
R47  29.53,10.16 180 top
R47'  15.88,10.16 180 top
R48  46.99,9.21 0 top
R49  38.73,10.16 90 top
R50  49.53,5.08 0 top
R51  40.96,10.16 90 top
R52  50.48,12.06 90 top
R53  52.7,12.06 90 top
R54  19.37,6.35 270 top
R54'  5.4,6.35 270 top
R55  23.81,6.35 270 top
R55'  9.84,6.35 270 top
VCCVEE  1.91,15.56 270 top
VDD_595  18.41,56.52 0 top
VDD_DAC  14.61,35.24 0 top

### Tracks (layer width: path | path; a pad name or v marks a point on that pad's centre or on a via)
+3V3  (via drill 0.6)
  Top 0.305: R27.2 65.09,47.31
  Top 0.61: MCU.EXT1-5 52.7,59.69 63.18,59.69 65.09,57.78 65.09,47.31 v65.09,43.18
  Bottom 0.61: 5V-ADC-3V3.3 63.18,41.27 v65.09,43.18
+5V  (via drill 0.6)
  Top 0.406: v20,43.5 20,43.18 14.61,37.78 VDD_DAC.1
  Top 0.61: 5V-ADC-3V3.1 53.34,43.5 v36.51,43.5 | v20,43.5 17.78,45.72 v17.78,53.02 16.51,54.29 C4.1 9.53,54.29 8.57,55.24 | IC6.3 8.57,56.83 8.57,55.24 | 8.57,55.24 C14.+
  Bottom 0.406: VDD_595.1 18.41,53.66 v17.78,53.02
  Bottom 0.61: 5V-ADC-3V3.1 57.47,39.37 57.47,37.47 56.2,36.2 | v36.51,43.5 v20,43.5
  Bottom 0.813: 56.2,36.2 MCU.EXT2-26
ADC_4
  Top 0.254: IC4.5 67.63,23.81 72.39,19.05 72.39,17.78 3208_EXP.1
ADC_5
  Top 0.254: 3208_EXP.2 73.66,19.05 73.66,20.32 70.17,23.81 IC4.6
ADC_6
  Top 0.254: 3208_EXP.3 73.66,21.59 73.66,22.86 72.71,23.81 IC4.7
ADC_7
  Top 0.254: 3208_EXP.4 75.25,22.54 IC4.8
ADC_MISO  (via drill 0.6)
  Top 0.254: v41.91,53.98 42.23,54.29 54.29,54.29 60.64,47.94 60.64,44.45 62.87,42.23 62.87,38.42 67.31,33.97 67.63,33.97 IC4.12
  Bottom 0.254: MCU.EXT1-14 41.91,62.87 v41.91,53.98
ADC_MOSI
  Top 0.254: IC4.11 70.17,33.97 69.22,34.92 67.31,34.92 63.5,38.73 63.5,42.55 61.28,44.77 61.28,48.26 54.61,54.93 41.59,54.93 36.83,59.69 30.8,59.69 29.21,61.28 29.21,62.87 MCU.EXT1-22
ADC_SCK  (via drill 0.6)
  Top 0.254: v36.83,58.42 37.15,58.42 40.64,54.93 40.64,53.66 41.27,53.02 42.55,53.02 43.18,53.66 53.98,53.66 60.01,47.62 60.01,44.13 62.23,41.91 62.23,38.1 65.09,35.24 IC4.13
  Bottom 0.254: MCU.EXT1-18 36.83,62.87 v36.83,58.42
ADC_SS
  Top 0.254: IC4.10 72.71,33.97 71.12,35.56 67.63,35.56 64.14,39.05 64.14,42.86 61.91,45.09 61.91,48.58 54.93,55.56 41.91,55.56 37.15,60.33 31.75,60.33 MCU.EXT1-21
AREF
  Top 0.305: R22.1 C8.1 34.14,27.31 IC3.1
  Top 0.406: DAC_ADAPTER.P$2 22.54,26.03 IC5.2 22.54,27.93 22.86,28.26 26.67,28.26 28.89,26.04 30.16,26.04 | 30.16,26.04 39.69,26.04 42.23,28.57 46.99,28.57 | IC4.15 60.01,31.43 57.15,28.57 46.99,28.57 | R22.1 30.16,26.04 | AVOLT.3 46.99,28.57
C28'
  Top 0.254: IC9'.1 7.88,9.78 7.3,9.21 6.03,9.21 5.4,8.57 R54'.1 5.72,7.3 C28'.2
DAC_A
  Top 0.254: IC5.4 25.26,26.81 DAC_ADAPTER.P$4 26.67,24.19 DAC_CONF.1 26.29,23.56 27.94,21.91 R42.1
DAC_B
  Top 0.254: IC5.3 23.18,26.03 DAC_ADAPTER.P$3 24.13,24.19 DAC_CONF.2
DAC_B_EN
  Top 0.254: R42'.1 14.29,20.64 15.24,21.59 24.13,21.59 24.83,22.29 DAC_CONF.3
DAC_MOSI
  Top 0.254: MCU.EXT2-19 47.94,38.73 45.4,41.27 43.18,41.27 42.55,41.91 41.27,41.91 40.64,41.27 23.81,41.27 22.23,39.69 22.23,34.29 21.59,33.66 DAC_ADAPTER.P$7 21.91,33.02 22.54,32.38 IC5.7
DAC_SCK  (via drill 0.6)
  Top 0.254: IC5.6 23.18,32.39 23.81,33.02 DAC_ADAPTER.P$6 24.13,33.66 22.86,34.92 22.86,39.37 24.13,40.64 41.59,40.64 v41.91,40.96
  Bottom 0.254: MCU.EXT2-16 41.91,37.47 v41.91,40.96
DAC_SS
  Top 0.254: IC5.5 25.26,31.61 DAC_ADAPTER.P$5 26.67,33.66 26.04,34.29 24.77,34.29 23.5,35.56 23.5,39.05 24.45,40.01 43.81,40.01 45.09,38.73 MCU.EXT2-17
DISP_CHAR0  (via drill 0.6)
  Top 0.254: v38.42,76.52 R3.1
  Bottom 0.254: v38.42,76.52 38.42,67.94 39.37,66.99 39.37,62.87 MCU.EXT1-15
DISP_CHAR1  (via drill 0.6)
  Top 0.254: v35.88,76.52 35.88,78.74 35.24,79.38 34.61,79.38 R11.1
  Bottom 0.254: MCU.EXT1-16 38.1,65.72 35.88,67.94 v35.88,76.52
DISP_CHAR2  (via drill 0.6)
  Top 0.254: v43.5,67.63 43.81,67.31 v61.28,67.31 | v61.28,74.61 61.28,75.25 62.55,76.52 R1.1
  Bottom 0.254: MCU.EXT1-12 43.5,64.77 v43.5,67.63 | v61.28,67.31 v61.28,74.61
DISP_CHAR3  (via drill 0.6)
  Top 0.254: 50.48,66.04 v50.8,66.36 49.85,65.41 49.85,64.14 48.26,62.55 41.59,62.55 MCU.EXT1-13 | v50.8,75.25 51.12,75.56 R2.1
  Bottom 0.254: v50.8,66.36 v50.8,75.25
DISP_EN  (via drill 0.6)
  Top 0.254: IC2.12 13.02,77.47 11.75,76.2 9.21,76.2 7.94,74.93 7.94,71.12 9.53,69.53 11.43,69.53 12.7,68.26 IC1.12 12.7,65.09 13.02,64.77 23.18,64.77 v23.5,65.09
  Bottom 0.254: v23.5,65.09 24.13,65.09 MCU.EXT1-26
DISP_SCK
  Top 0.254: IC2.11 11.75,77.47 11.11,76.83 8.89,76.83 7.3,75.25 7.3,70.8 9.21,68.9 10.48,68.9 11.43,67.94 IC1.11 11.43,64.77 12.06,64.14 23.81,64.14 24.77,65.09 47.31,65.09 MCU.EXT1-8
DISP_SER  (via drill 0.6)
  Top 0.254: v45.72,66.04 45.4,65.72 25.08,65.72 24.77,66.04 23.81,66.04 20,69.85 v19.68,69.85 | v14.92,77.47 15.56,78.11 IC2.14
  Bottom 0.254: MCU.EXT1-10 v45.72,66.04 | v19.68,69.85 17.78,69.85 14.92,72.39 v14.92,77.47
ENC_A  (via drill 0.6)
  Top 0.254: v31.75,58.74 26.67,58.74 26.04,59.37 20.32,59.37 17.46,62.23 6.35,62.23 3.17,65.41 3.17,70.48 3.81,71.12 3.81,73.34 ENC.3
  Bottom 0.254: MCU.EXT1-20 31.75,62.87 v31.75,58.74
ENC_B  (via drill 0.6)
  Top 0.254: v33.02,57.47 31.75,57.47 31.11,58.1 26.35,58.1 25.72,58.74 20,58.74 17.14,61.59 6.03,61.59 2.54,65.09 ENC.4
  Bottom 0.254: MCU.EXT1-19 v33.02,57.47
ENC_CLICK  (via drill 0.6)
  Top 0.254: v26.67,60.01 20.64,60.01 17.78,62.87 6.67,62.87 3.81,65.72 3.81,70.17 4.45,70.8 4.45,73.66 3.81,74.3 3.81,78.74 2.86,79.69 ENC.1
  Bottom 0.254: MCU.EXT1-24 26.67,62.87 v26.67,60.01
FM_CV
  Top 0.254: C17.2 R33.2 65.41,12.48 IC7.7 64.45,14.92 65.09,15.56 67.94,15.56 69.53,17.14 69.53,20.32 65.09,24.45 IC4.4
GATE  (via drill 0.6)
  Top 0.254: v59.05,45.09 58.74,44.77 38.42,44.77 v38.1,45.09 | R27.1 69.21,45.87 Q6.C 66.82,45.23 v66.67,45.09
  Bottom 0.254: v59.05,45.09 v66.67,45.09 | v38.1,45.09 MCU.EXT2-11
GND  (via drill 0.6)
  other vias: 25.4,24.77 38.1,19.05 49.53,17.78 37.78,13.65 48.58,20 44.13,6.99 45.09,16.51 62.87,15.56 7.62,1.27 22.86,1.27 41.27,1.27 50.16,1.27 69.85,1.27 61.28,1.27 34.61,1.27 72.39,10.16 77.47,27.94 77.47,34.29 77.47,42.86 33.66,19.68 49.85,84.45 49.85,69.22 20.32,83.5 10.48,82.87 13.65,68.9 9.84,74.93 39.37,92.08 45.09,92.08 50.16,92.08 55.24,92.08 60.33,92.08 65.72,92.08 71.12,92.08 33.66,92.08 28.26,92.08 22.54,92.08 17.14,92.08 12.38,92.08 7.3,92.08 77.47,86.36 77.47,81.28 77.47,76.2 77.47,71.12 77.47,59.37 1.27,69.22 63.82,53.66 77.47,53.66 77.47,47.62 22.86,33.34 25.4,33.34 1.27,82.87 29.21,5.4 64.77,3.81 50.8,41.27 55.56,56.83 29.21,60.01 49.53,34.29 20.64,85.72 37.15,81.92 53.34,52.39 59.05,47.31 44.45,52.39 25.72,56.52 12.7,49.53 12.7,24.13 17.14,38.1 31.75,34.29 40.64,34.29 37.47,67.63 72.39,5.08 24.57,16.83 11.05,16.83 54.61,23.5 34.29,7.94 6.67,68.26 7.94,78.11 15.56,70.17
  pour Top: 0,93.34 78.74,93.34 78.74,0 0,0
  pour Bottom: 0,93.34 78.74,93.34 78.74,0 0,0
GPIO_0
  Bottom 0.254: MCU.EXT2-12 39.69,37.78 39.69,43.5 41.59,45.4 GPIO.1
GPIO_1
  Bottom 0.254: MCU.EXT2-13 40.64,41.91 44.13,45.4 GPIO.2
GPIO_2
  Bottom 0.254: MCU.EXT2-22 49.53,37.47 49.53,42.55 46.67,45.4 GPIO.3
GPIO_3
  Bottom 0.254: MCU.EXT2-24 51.75,37.78 51.75,42.86 49.21,45.4 GPIO.4
N$1  (via drill 0.6)
  Top 0.254: IC1.14 15.24,68.58 13.65,70.17 10.16,70.17 v9.84,70.48 | v6.67,70.17 6.67,75.56 9.21,78.11 IC2.9
  Bottom 0.254: v9.84,70.48 6.99,70.48 v6.67,70.17
N$2  (via drill 0.6)
  Top 0.254: Q3.C 43.65,79.86 v42.23,81.28
  Bottom 0.254: v42.23,81.28 DISP2.16
N$3  (via drill 0.6)
  Top 0.254: DISP2.12 30.8,83.19 25.3,83.19 R9.2 | v32.07,88.9 32.38,88.58 39.37,88.58 40.32,87.63 44.45,87.63 45.09,87 46.67,87 47.31,86.36 51.44,86.36 52.07,85.72 56.2,85.72 DISP1.12
  Bottom 0.254: DISP2.12 v32.07,88.9
N$4
  Top 0.61: POWER.10 POWER.9 9.53,43.81 D2.C
N$5  (via drill 0.6)
  Top 0.254: R9.1 v21.91,83.5 | v16.83,80.96 IC2.15
  Bottom 0.254: v21.91,83.5 19.37,80.96 v16.83,80.96
N$6
  Top 0.61: POWER.2 POWER.1 6.67,33.66 D1.A
N$7
  Top 0.254: IC2.1 18.95,84.45 22.23,84.45 22.86,85.09 R10.1
N$8
  Top 0.254: IC2.2 16.83,83.82 17.14,83.5 17.78,83.5 22.54,78.74 R12.1
N$9
  Top 0.254: IC2.3 15.56,83.5 16.19,82.87 17.46,82.87 21.59,78.74 21.59,77.79 22.23,77.15 R18.1
N$10
  Top 0.254: R13.1 21.91,75.56 20.95,76.52 20.95,78.42 17.14,82.23 15.24,82.23 14.29,83.19 IC2.4
N$11  (via drill 0.6)
  Top 0.254: IC2.5 13.02,83.82 v13.34,83.5 | v13.34,89.22 13.65,88.9 20.64,88.9 21.59,89.85 R4.1
  Bottom 0.254: v13.34,83.5 v13.34,89.22
N$12  (via drill 0.6)
  Top 0.254: IC2.6 11.75,83.82 v12.06,83.5 | v12.06,88.27 12.38,87.95 21.27,87.95 21.59,88.27 R5.1
  Bottom 0.254: v12.06,83.5 v12.06,88.27
N$13
  Top 0.254: IC2.7 10.48,86.36 11.43,87.31 20.95,87.31 21.59,86.68 R6.1
N$14  (via drill 0.6)
  Top 0.254: IC1.15 16.51,68.9 v19.05,71.44 | v21.91,80.64 22.23,80.33 R7.1
  Bottom 0.254: v19.05,71.44 21.91,74.3 v21.91,80.64
N$15
  Top 0.254: R17.1 22.54,69.22 19.05,72.71 17.88,72.71 IC1.1
N$16
  Top 0.254: R16.1 21.91,70.8 18.73,73.98 16.83,73.98 16.51,73.66 IC1.2
N$17
  Top 0.254: R15.1 21.27,72.39 19.05,74.61 16.19,74.61 15.24,73.66 IC1.3
N$18
  Top 0.254: R14.1 20.64,73.98 19.37,75.25 15.56,75.25 13.97,73.66 IC1.4
N$19  (via drill 0.6)
  Top 0.254: IC1.5 12.7,73.66 14.92,75.88 20,75.88 v20.64,75.25 | v21.91,81.92 R8.1
  Bottom 0.254: v20.64,75.25 20.64,80.64 v21.91,81.92
N$20  (via drill 0.6)
  Top 0.254: R10.2 26.35,85.09 DISP2.10 | v29.53,88.27 29.84,87.95 39.05,87.95 40.01,87 44.13,87 44.77,86.36 46.35,86.36 46.99,85.72 51.12,85.72 DISP1.10
  Bottom 0.254: DISP2.10 26.99,85.72 v29.53,88.27
N$21  (via drill 0.6)
  Top 0.254: R12.2 v26.67,78.74 | v28.89,73.98 29.21,73.66 34.92,73.66 35.56,73.03 37.15,73.03 37.78,72.39 39.37,72.39 40.01,71.75 44.13,71.75 44.77,71.12 46.35,71.12 46.99,70.48 51.12,70.48 DISP1.9
  Bottom 0.254: v26.67,78.74 24.77,77.15 24.77,71.44 DISP2.9 28.89,71.12 v28.89,73.98
N$22  (via drill 0.6)
  Top 0.254: R18.2 26.04,77.15 28.26,74.93 29.84,74.93 v30.16,74.61 | v32.07,74.61 32.38,74.3 35.24,74.3 35.88,73.66 37.47,73.66 38.1,73.03 39.69,73.03 40.32,72.39 44.45,72.39 45.09,71.75 46.67,71.75 47.31,71.12 51.44,71.12 52.07,70.48 56.2,70.48 DISP1.7
  Bottom 0.254: v30.16,74.61 30.16,71.12 DISP2.7 v32.07,74.61
N$23  (via drill 0.6)
  Top 0.254: R16.2 25.4,71.12 33.66,71.12 34.29,70.48 35.88,70.48 DISP2.5 | v37.15,75.25 37.47,74.93 38.1,74.93 38.73,74.3 40.32,74.3 40.96,73.66 45.09,73.66 45.72,73.03 47.31,73.03 47.94,72.39 52.07,72.39 52.7,71.75 56.83,71.75 57.47,71.12 60.64,71.12 DISP1.5
  Bottom 0.254: DISP2.5 v37.15,75.25
N$24  (via drill 0.6)
  Top 0.254: R13.2 26.04,75.56 28.57,73.03 34.61,73.03 35.24,72.39 36.83,72.39 37.47,71.75 39.05,71.75 39.69,71.12 43.81,71.12 44.45,70.48 46.04,70.48 DISP2.1 | v47.31,75.25 47.62,74.93 48.26,74.93 48.9,74.3 53.02,74.3 53.66,73.66 57.78,73.66 58.42,73.03 61.59,73.03 62.87,71.75 64.45,71.75 65.09,71.12 69.22,71.12 69.85,70.48 71.44,70.48 DISP1.1
  Bottom 0.254: DISP2.1 v47.31,75.25
N$25  (via drill 0.6)
  Top 0.254: DISP2.18 46.04,85.72 44.45,85.72 43.81,86.36 39.69,86.36 38.73,87.31 28.57,87.31 26.04,89.85 R4.2 | v47.31,80.64 47.62,80.96 61.91,80.96 62.87,81.92 64.45,81.92 65.09,82.55 69.22,82.55 69.85,83.19 71.44,83.19 DISP1.18
  Bottom 0.254: DISP2.18 v47.31,80.64
N$26  (via drill 0.6)
  Top 0.254: DISP2.17 43.5,85.72 39.37,85.72 38.58,86.52 38.42,86.68 27.62,86.68 26.04,88.27 R5.2 | v44.77,81.28 45.09,81.6 61.59,81.6 62.55,82.55 64.14,82.55 64.77,83.19 68.9,83.19 DISP1.17
  Bottom 0.254: DISP2.17 v44.77,81.28
N$27  (via drill 0.6)
  Top 0.254: DISP2.15 38.1,86.04 26.67,86.04 26.04,86.68 R6.2 | v39.69,81.92 40.01,82.23 61.28,82.23 62.23,83.19 63.82,83.19 DISP1.15
  Bottom 0.254: DISP2.15 v39.69,81.92
N$28
  Top 0.254: R7.2 26.04,80.64 27.3,81.92 31.43,81.92 32.07,82.55 33.66,82.55 34.29,83.19 35.88,83.19 DISP2.14 38.73,82.87 60.96,82.87 DISP1.14
N$29  (via drill 0.6)
  Top 0.254: DISP2.6 33.34,70.48 26.25,70.48 R17.2 | v34.61,75.25 34.92,74.93 35.56,74.93 36.2,74.3 37.78,74.3 38.42,73.66 40.01,73.66 40.64,73.03 44.77,73.03 45.4,72.39 46.99,72.39 47.62,71.75 51.75,71.75 52.39,71.12 56.52,71.12 57.15,70.48 58.74,70.48 DISP1.6
  Bottom 0.254: DISP2.6 v34.61,75.25
N$30  (via drill 0.6)
  Top 0.254: R15.2 26.35,72.39 26.99,71.75 33.97,71.75 34.61,71.12 36.2,71.12 36.83,70.48 38.42,70.48 DISP2.4 | v39.69,75.25 40.01,74.93 40.64,74.93 41.27,74.3 45.4,74.3 46.04,73.66 47.62,73.66 48.26,73.03 52.39,73.03 53.02,72.39 57.15,72.39 57.78,71.75 60.96,71.75 62.23,70.48 63.82,70.48 DISP1.4
  Bottom 0.254: DISP2.4 v39.69,75.25
N$31  (via drill 0.6)
  Top 0.254: R14.2 26.35,73.98 27.94,72.39 34.29,72.39 34.92,71.75 36.51,71.75 37.15,71.12 38.73,71.12 39.37,70.48 43.5,70.48 DISP2.2 | v44.77,75.25 45.09,74.93 45.72,74.93 46.35,74.3 47.94,74.3 48.58,73.66 52.7,73.66 53.34,73.03 57.47,73.03 58.1,72.39 61.28,72.39 62.55,71.12 64.14,71.12 64.77,70.48 68.9,70.48 DISP1.2
  Bottom 0.254: DISP2.2 v44.77,75.25
N$32  (via drill 0.6)
  Top 0.254: R8.2 26.04,81.92 26.67,82.55 31.11,82.55 31.75,83.19 33.34,83.19 DISP2.13 | v34.61,89.53 34.92,89.22 39.69,89.22 40.64,88.27 44.77,88.27 45.4,87.63 46.99,87.63 47.62,87 51.75,87 52.39,86.36 56.52,86.36 57.15,85.72 58.74,85.72 DISP1.13
  Bottom 0.254: DISP2.13 v34.61,89.53
N$33
  Top 0.254: Q3.B R3.2
N$34
  Top 0.254: R11.2 Q4.B
N$35  (via drill 0.6)
  Top 0.254: Q4.C 30.33,80.16 v29.53,80.96
  Bottom 0.254: v29.53,80.96 DISP2.11
N$36  (via drill 0.6)
  Top 0.254: Q1.C 66.82,80.16 v67.63,81.28
  Bottom 0.254: v67.63,81.28 DISP1.16
N$37
  Top 0.254: Q1.B R1.2
N$38
  Top 0.254: Q2.B R2.2
N$39  (via drill 0.6)
  Top 0.254: v54.93,80.01 55.39,79.55 Q2.C
  Bottom 0.254: DISP1.11 v54.93,80.01
N$41
  Top 0.254: 21.27,19.68 C20.1 R43.1 23.5,19.68 R42.2
N$42
  Top 0.254: IC9.5 C21.1 25.72,17.78 23.81,17.78 23.5,18.1 R43.2
N$43
  Top 0.254: C20.2 21.27,17.14 21.91,16.51 22.86,16.51 23.5,15.88 IC9.7 IC9.6 24.77,13.97 25.4,13.34 27.88,13.34 C23.+
N$44
  Top 0.254: C28.1 R55.1 23.5,7.62 IC9.2 23.5,10.79 24.45,11.75 27.62,11.75 28.89,10.47
  Top 0.61: 28.89,10.47 R47.2
N$45
  Top 0.254: C23.- 30.54,10.54 R47.1
N$46
  Top 0.254: IC9.1 22.16,9.84 20.32,9.84 19.37,8.89 R54.1 C28.2
N$47
  Top 0.254: 39.06,9.21 R49.1 40.63,11.11 | FM_ATT.3 53.98,4.13 53.66,4.45 52.7,4.45 52.07,5.08 R50.2 50.48,6.04 50.16,6.35 46.04,6.35 45.72,6.03 43.81,6.03 42.86,6.99 38.1,6.99 36.51,8.57 36.51,13.65 38.1,15.24 40.01,15.24 40.64,14.61 IC8.2 40.64,11.12 40.63,11.11 | R51.2 40.63,11.11
N$48
  Top 0.254: IC8.1 38.73,13.28 R49.2 38.73,11.43 37.78,11.43 37.47,11.11 37.47,8.57 38.1,7.94 44.77,7.94 45.4,7.3 62.23,7.3 63.18,8.26 R38.1
N$49
  Top 0.254: R50.1 44.13,5.08 43.18,4.13 FM.2
N$50
  Top 0.254: IC8.7 47.94,12.96 C25.2 R48.2 49.21,9.21 50.48,7.94 57.78,7.94 58.1,8.26 R34.1
N$51
  Top 0.254: 45.72,11.43 IC8.6 45.72,14.61 46.35,15.24 49.53,15.24 50.48,14.29 R52.2 R53.2 | 45.72,11.43 C25.1 | 45.72,11.43 45.72,9.21 R48.1
N$52
  Top 0.254: R39.2 40.32,23.49 R29.1 38.42,20.06 IC8.14
N$53
  Top 0.254: R39.1 IC8.13 40.64,18.1 40.32,17.78 37.15,17.78 35.24,15.88 | PARAM1_ATT.3 27.62,6.03 28.89,7.3 32.38,7.3 33.97,8.89 33.97,14.92 34.61,15.56 R45.2
  Top 0.305: 35.24,15.88 R45.2
N$54
  Top 0.254: R41.2 C19.2 48.27,23.49 R31.1 50.16,20 49.21,19.05 47.05,19.05 IC8.8
N$55  (via drill 0.6)
  Top 0.254: C19.1 R41.1 IC8.9 45.72,18.1 47.62,16.19 50.16,16.19 52.07,14.29 54.61,14.29 54.93,13.97 v55.24,13.97 | R40.2 R44.2 68.9,13.02 68.26,13.65 v66.04,13.65
  Bottom 0.254: v66.04,13.65 55.56,13.65 v55.24,13.97
N$56
  Top 0.254: R31.2 51.12,23.49 51.75,22.86 51.75,18.73 53.66,16.83 56.83,16.83 57.47,17.46 62.87,17.46 63.18,17.78 | IC7.9 63.18,17.78 | R25.1 66.04,17.78 63.18,17.78
N$57  (via drill 0.6)
  Top 0.254: IC7.6 R38.2 63.51,11.11 R33.1 | R33.1 C17.1 | v65.41,7.62 R33.1
  Bottom 0.254: FM_ATT.1 59.05,5.4 60.33,6.67 64.45,6.67 v65.41,7.62
N$58
  Top 0.254: IC7.2 R34.2 57.78,11.11 R32.1
N$59  (via drill 0.6)
  Top 0.254: IC7.13 58.1,18.41 57.78,18.1 53.98,18.1 53.34,18.73 C13.1 R26.1 53.34,21.91 53.34,24.13 52.39,25.08 38.73,25.08 38.42,24.77 R29.2 37.78,23.5 36.83,22.54 36.83,19.68 33.02,15.88 v33.02,9.21
  Bottom 0.254: PARAM1_ATT.1 32.7,8.89 v33.02,9.21
N$60
  Top 0.254: R28.2 Q6.B
N$61  (via drill 0.6)
  Top 0.254: R23.2 51.75,2.86 v52.07,3.17
  Bottom 0.254: v52.07,3.17 53.34,4.45 55.88,4.45 56.52,3.81 FM_ATT.2
N$63  (via drill 0.6)
  Top 0.61: VDD_595.3 23.5,43.5 24.77,42.23 v25.08,42.23
  Bottom 0.406: VDD_DAC.3 19.68,40.01 21.91,42.23 v25.08,42.23
  Bottom 0.61: MCU.EXT2-5 30.48,40.96 29.21,42.23 v25.08,42.23
N$64
  Top 0.254: MCU.EXT1-2 GPIO_DIG.1
N$65
  Top 0.254: MCU.EXT1-4 54.61,65.41 73.03,65.41 74.3,66.67 GPIO_DIG.2
N$66
  Top 0.254: R28.1 GATE_IN.1
N$67
  Top 0.254: FM.1 46.35,2.86 R23.1
N$69  (via drill 0.6)
  Top 0.254: PITCH.1 66.04,4.76 64.45,6.35 v53.02,6.35 | v52.7,9.21 R53.1
  Bottom 0.254: v53.02,6.35 52.7,6.67 v52.7,9.21
N$70  (via drill 0.6)
  Top 0.254: PITCH.2 63.5,4.76 62.55,5.71 53.98,5.71 53.66,5.4 52.7,5.4 v51.75,6.35 | v50.8,9.53 50.48,9.84 R52.1
  Bottom 0.254: v50.8,9.53 51.44,8.89 51.44,6.67 v51.75,6.35
N$71
  Top 0.254: PARAM2.1 76.2,4.45 74.3,6.35 R44.1
N$72
  Top 0.254: PARAM2.2 73.66,3.49 73.03,4.13 R40.1
N$73  (via drill 0.6)
  Top 0.254: v35.24,8.89 R45.1
  Bottom 0.254: PARAM1.2 36.51,7.62 v35.24,8.89
N$74
  Top 0.254: PARAM1.1 39.05,4.76 37.47,6.35 R46.1
N$75
  Top 0.254: PARAM1_ATT.2 30.16,4.76 31.75,6.35 R46.2
N$76
  Top 0.254: R42'.2 10.16,19.68 | 10.16,19.68 R43'.1 | 10.16,19.68 7.94,19.68 C20'.1
N$77
  Top 0.254: IC9'.5 C21'.1 12.07,17.78 10.48,17.78 10.16,18.1 R43'.2 10.16,17.78
N$78
  Top 0.254: C20'.2 7.62,17.14 8.26,16.51 9.21,16.51 9.84,15.88 IC9'.7 IC9'.6 11.11,13.97 11.75,13.34 14.22,13.34 C23'.+
N$79
  Top 0.254: C28'.1 R55'.1 IC9'.2 9.84,10.79 10.79,11.75 13.97,11.75 14.92,10.79 R47'.2
N$80
  Top 0.254: C23'.- 16.89,10.54 R47'.1
OUT_A
  Top 0.254: R55.2 23.5,4.76 22.86,4.13 19.37,4.13 | 19.37,4.13 18.1,4.13 17.14,3.17 AUDIO_OUT.1 | R54.2 19.37,4.13
OUT_B
  Top 0.254: R54'.2 5.4,4.76 6.03,4.13 9.84,4.13 | 9.84,4.13 R55'.2 | 9.84,4.13 10.16,4.13 AUDIO_OUT.3
PARAM1_CV
  Top 0.254: IC7.14 56.73,19.68 C13.2 R26.2 56.52,21.59 57.47,22.54 IC4.1
PARAM2_CV
  Top 0.254: IC4.2 60.01,22.54 60.96,21.59 63.18,21.59 64.45,20.32 | 64.45,20.32 IC7.8 | 64.45,20.32 65.72,20.32 R25.2
PITCH_CV
  Top 0.254: R32.2 55.88,12.48 IC7.1 56.83,14.92 58.42,16.51 67.31,16.51 68.26,17.46 68.26,19.68 65.72,22.23 64.14,22.23 62.55,23.5 IC4.3
VCC  (via drill 0.6)
  Top 0.254: 43.17,11.43 R51.1
  Top 0.305: 22.16,14.92 C22.1 | C27.1 43.17,11.43 | 8.57,14.92 IC9'.8
  Top 0.406: IC9.8 22.16,14.92 | C27.1 IC8.4 43.18,15.24 41.91,16.51 v39.21,16.51 | C22.1 22.23,14.92 v22.23,13.02 | C22'.1 8.57,14.92 v8.57,13.02
  Top 0.61: D1.C 8.26,42.23 9.53,40.96 9.53,33.34 C24.+ 1.91,25.72 VCCVEE.1 | C16.+ IC6.1
  Bottom 0.305: v8.57,13.02 8.57,12.06
  Bottom 0.406: v22.23,13.02 22.23,12.06
  Bottom 0.61: VCCVEE.1 v5.4,12.06 8.57,12.06 22.23,12.06 33.81,12.06 38.26,16.51 v39.21,16.51 | D1.C 7.94,46.67 C16.+
VDD_595  (via drill 0.6)
  Top 0.406: 17.78,66.36 IC1.16 17.78,66.36 C2.1 v20.95,66.36 | IC2.10 v10.48,81.28 8.57,81.28 6.99,79.69 6.99,78.11 5.4,76.52 5.4,66.67 7.62,64.45 v10.16,64.45 IC1.10 | C1.1 19.05,78.42 v19.37,78.74 18.41,78.74 18.1,78.42 IC2.16
  Bottom 0.406: VDD_595.2 20.95,63.5 | 20.95,63.5 v20.95,66.36 | v19.37,78.74 18.41,79.69 15.56,79.69 13.97,81.28 v10.48,81.28 | v10.16,64.45 12.38,64.45 13.34,63.5 20.95,63.5
VDD_ADC
  Top 0.406: C6.1 C7.1 57.15,33.34 IC4.16 58.1,33.66 5V-ADC-3V3.2
VDD_DAC
  Top 0.406: C12.1 C11.1 18.73,25.09 DAC_ADAPTER.P$1 | IC5.1 20.46,26.81 DAC_ADAPTER.P$1 | DAC_ADAPTER.P$1 19.05,30.8 17.14,32.7 VDD_DAC.2
VDDA  (via drill 0.6)
  Top 0.406: C15.1 IC7.4 v60.64,15.56 | v29.21,30.8 30.16,30.8 | 30.16,30.8 AVOLT.1 | v45.09,27.3 52.39,27.3 v56.2,23.5 | R22.2 30.16,30.8
  Bottom 0.406: MCU.EXT2-1 26.67,37.47 28.57,37.47 29.21,36.83 v29.21,30.8 | AVOLT.1 v45.09,27.3 | v56.2,23.5 56.2,20 v60.64,15.56
VEE  (via drill 0.6)
  Top 0.305: IC9.4 26.09,9.78
  Top 0.406: C18.2 IC8.11 v43.18,17.78 | 12.44,9.78 IC9'.4 12.38,9.53 | C26'.2 12.38,9.53 | 12.38,9.53 v13.34,9.53 | IC9.4 26.04,9.53 | 26.04,9.53 C26.2 | 26.09,9.78 26.09,9.59 26.04,9.53 | 26.04,9.53 v26.99,9.53
  Top 0.61: VCCVEE.3 5.08,13.65 5.08,24.77 C29.- 11.11,30.8 D2.A
  Bottom 0.406: v13.34,9.53 13.34,10.48 | v26.99,9.53 26.99,10.48
  Bottom 0.61: v43.18,17.78 43.18,17.14 36.51,10.48 26.99,10.48 13.34,10.48 VCCVEE.3

### Text on the board
tPlace: PA9 | PA8 | 595/LED | 5V | 3V3 | red stripe here! | PC4 | PC5 | PC8 | PC9 | -12V | 5V | ADC (5V H405 only!) | 3V3 | 5V | DAC | 3V3 | 3V3A | AREF | GND | B | A | AUDIO_B / for 8552 | 7 | OUT | 8551: B>A / 8552: B>OUT | 6 | VCC | 5 | 3208 channels | 4 | GND | VEE
bPlace: CLICK | GND | ENC_A | ENC_B | GATE | GND | 3V3A | AREF | GND | << bridge for 3204 | VCC | GND | VEE | AUDIO_B | GND | AUDIO_A | 3 | 2 | 1 | POT | CV | POT | CV | 3 | 2 | 1 | POT | CV | POT | CV
tNames: Braids construction kit v0.1 | Based on | Braids | v03 | by Olivier Gillet/Mutable Instruments | Experimental layout for Olimex STM32H103/H405 / with bonus features / by Patrick Dowling 05/2015